# Altium schematic sheet CU.SchDoc
size A4
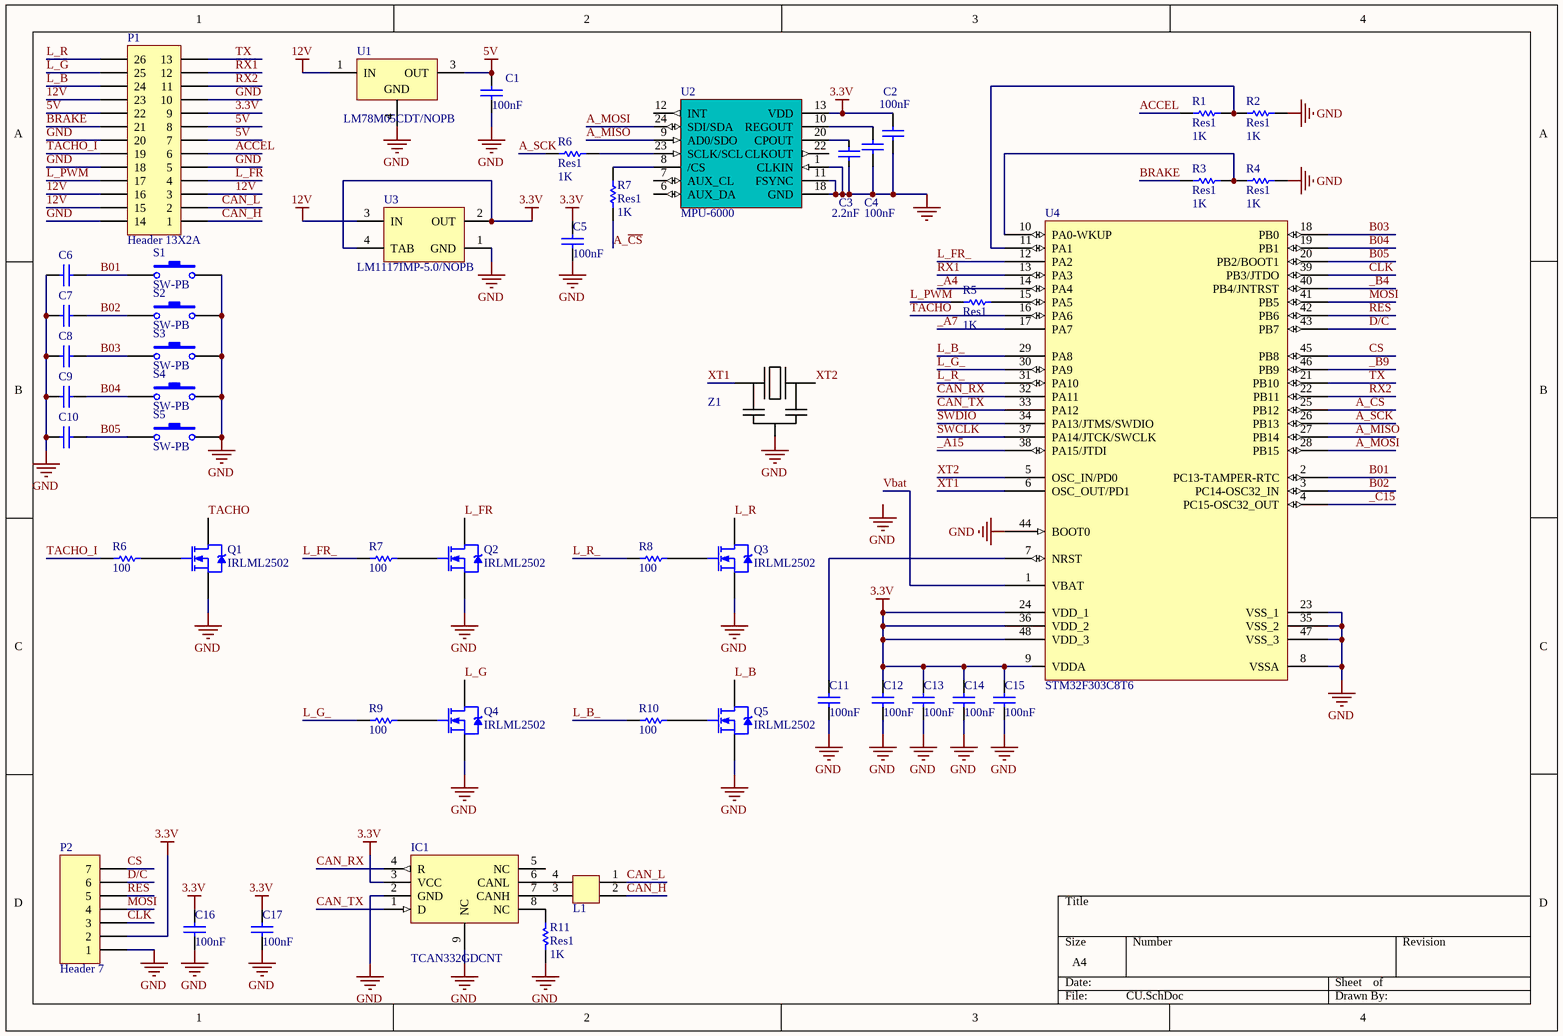
[diagram p0: CU.SchDoc]

## Parts
(Parts that share a designator on the sheet are numbered #1, #2 ... from top to bottom, then left to right.)
C1  value 100nF  [RR_B]  (hidden comment: Cap)
C2  value 100nF  [0603x]  (hidden comment: Cap402)
C3  value 2.2nF  [0603x]  (hidden comment: Cap603)
C4  value 100nF  [0402x]  (hidden comment: Cap402)
C5  value 100nF  [RR_B]  (hidden comment: Cap)
C6  Cap  [0402]  (value not drawn)
C7  Cap  [0402]  (value not drawn)
C8  Cap  [0402]  (value not drawn)
C9  Cap  [0402]  (value not drawn)
C10  Cap  [0402]  (value not drawn)
C11  value 100nF  [0402x]  (hidden comment: Cap)
C12  value 100nF  [0402x]  (hidden comment: Cap)
C13  value 100nF  [0402x]  (hidden comment: Cap)
C14  value 100nF  [0402x]  (hidden comment: Cap)
C15  value 100nF  [0402x]  (hidden comment: Cap)
C16  value 100nF  [0603x]  (hidden comment: Cap)
C17  value 100nF  [0603x]  (hidden comment: Cap)
IC1  TCAN332GDCNT  [RR_DFN8_3X3]
L1  CMC 100MA 2LN 90 OHM SMD  [Choke_smd]  (value not drawn)
P1  Header 13X2A  [HDR2X13_WIDE]
P2  Header 7  [OLED_DISPLAY_2.42]
Q1  IRLML2502  [SOT-23_N]
Q2  IRLML2502  [SOT-23_N]
Q3  IRLML2502  [SOT-23_N]
Q4  IRLML2502  [SOT-23_N]
Q5  IRLML2502  [SOT-23_N]
R1  Res1  value 1K  [0603x]
R2  Res1  value 1K  [0603x]
R3  Res1  value 1K  [0603x]
R4  Res1  value 1K  [0603x]
R5  Res1  value 1K  [0603x]
R6#1  Res1  value 1K  [0805x]
R6#2  value 100  [0603x]
R7#1  Res1  value 1K  [0603x]
R7#2  value 100  [0603x]
R8  value 100  [0603x]
R9  value 100  [0603x]
R10  value 100  [0603x]
R11  Res1  value 1K  [0603x]
S1  SW-PB  [BTN_WATEPROOF_RIGHT]
S2  SW-PB  [BTN_WATEPROOF_RIGHT]
S3  SW-PB  [BTN_WATEPROOF_RIGHT]
S4  SW-PB  [BTN_WATEPROOF_RIGHT]
S5  SW-PB  [BTN_WATEPROOF_RIGHT]
U1  LM78M05CDT/NOPB  [TD03B_N]
U2  MPU-6000  [IMU-3000]
U3  LM1117IMP-5.0/NOPB  [MP04A_N]
U4  STM32F303C8T6  [LQFP48_N]
Z1  AWSCR-8.00CV-T  [CRYSTAL_3.2X1.3]  (value not drawn)

## Nets
3.3V: C2.2 C5.2 C12.2 C13.2 C14.2 C15.2 C16.2 C17.2 IC1.3(VCC) P1.9 P2.2 U2.13(VDD) U3.2(OUT) U3.4(TAB) U4.9(VDDA) U4.24(VDD_1) U4.36(VDD_2) U4.48(VDD_3)
5V: C1.2 P1.7 P1.8 P1.22 U1.3(OUT)
12V: P1.3 P1.15 P1.16 P1.23 U1.1(IN) U3.3(IN)
GND: C1.1 C2.1 C3.1 C4.2 C5.1 C6.2 C7.2 C8.2 C9.2 C10.2 C11.1 C12.1 C13.1 C14.1 C15.1 C16.1 C17.1 IC1.2(GND) IC1.9(NC) P1.5 P1.10 P1.14 P1.18 P1.20 P2.1 Q1.2(S) Q2.2(S) Q3.2(S) Q4.2(S) Q5.2(S) R2.2 R4.2 R11.2 S1.1 S2.1 S3.1 S4.1 S5.1 U1.4(GND) U2.1(CLKIN) U2.11(FSYNC) U2.18(GND) U3.1(GND) U4.8(VSSA) U4.23(VSS_1) U4.35(VSS_2) U4.44(BOOT0) U4.47(VSS_3) Z1.2(GND)
_A4: U4.14(PA4)
_A7: U4.17(PA7)
_A15: U4.38(PA15/JTDI)
_B4: U4.40(PB4/JNTRST)
_B9: U4.46(PB9)
_C15: U4.4(PC15-OSC32_OUT)
A_~{CS}: R7#1.1 U4.25(PB12)
A_MISO: U2.9(AD0/SDO) U4.27(PB14)
A_MOSI: U2.24(SDI/SDA) U4.28(PB15)
A_SCK: R6#1.1 U4.26(PB13)
ACCEL: P1.6 R1.1
B01: C6.1 S1.2 U4.2(PC13-TAMPER-RTC)
B02: C7.1 S2.2 U4.3(PC14-OSC32_IN)
B03: C8.1 S3.2 U4.18(PB0)
B04: C9.1 S4.2 U4.19(PB1)
B05: C10.1 S5.2 U4.20(PB2/BOOT1)
BRAKE: P1.21 R3.1
CAN_H: L1.2 P1.1
CAN_L: L1.1 P1.2
CAN_RX: IC1.4(R) U4.32(PA11)
CAN_TX: IC1.1(D) U4.33(PA12)
CLK: P2.3 U4.39(PB3/JTDO)
CS: P2.7 U4.45(PB8)
D/C: P2.6 U4.43(PB7)
L_B: P1.24 Q5.3(D)
L_B_: R10.2 U4.29(PA8)
L_FR: P1.4 Q2.3(D)
L_FR_: R7#2.2 U4.12(PA2)
L_G: P1.25 Q4.3(D)
L_G_: R9.2 U4.30(PA9)
L_PWM: P1.17 R5.1
L_R: P1.26 Q3.3(D)
L_R_: R8.2 U4.31(PA10)
MOSI: P2.4 U4.41(PB5)
RES: P2.5 U4.42(PB6)
RX1: P1.12 U4.13(PA3)
RX2: P1.11 U4.22(PB11)
SWCLK: U4.37(PA14/JTCK/SWCLK)
SWDIO: U4.34(PA13/JTMS/SWDIO)
TACHO: Q1.3(D) U4.16(PA6)
TACHO_I: P1.19 R6#2.2
TX: P1.13 U4.21(PB10)
Vbat: U4.1(VBAT)
XT1: U4.6(OSC_OUT/PD1) Z1.1(X1)
XT2: U4.5(OSC_IN/PD0) Z1.3(X2)
NetC3_2: C3.2 U2.20(CPOUT)
NetC4_1: C4.1 U2.10(REGOUT)
NetC11_2: C11.2 U4.7(NRST)
NetIC1_6: IC1.6(CANL) L1.4
NetIC1_7: IC1.7(CANH) L1.3
NetIC1_8: IC1.8(NC) R11.1
NetQ1_1: Q1.1(G) R6#2.1
NetQ2_1: Q2.1(G) R7#2.1
NetQ3_1: Q3.1(G) R8.1
NetQ4_1: Q4.1(G) R9.1
NetQ5_1: Q5.1(G) R10.1
NetR1_2: R1.2 R2.1 U4.11(PA1)
NetR3_2: R3.2 R4.1 U4.10(PA0-WKUP)
NetR5_2: R5.2 U4.15(PA5)
NetR6#1_2: R6#1.2 U2.23(SCLK/SCL)
NetR7#1_2: R7#1.2 U2.8(/CS)

Not connected (* = marked no-connect by the designer): IC1 5(NC); U2 2(NC) 3(NC) 4(NC) 5(NC) 6(AUX_DA) 7(AUX_CL) 12(INT) 14(NC) 15(NC) 16(NC) 17(NC) 19(RESV) 21(RESV) 22(CLKOUT)

## Notes on the sheet
- Labels drawn without touching a wire or pin: GND

## Library data of the parts
C1 C5 C11-C17 = Cap: Capacitor; Published: 8-Jun-2000; LatestRevisionDate: 17-Jul-2002; LatestRevisionNote: Re-released for DXP Platform.; PackageReference: RAD-0.3; Publisher: Altium Limited; PackageDescription: Radial Cap, Thru-Hole; 2 Leads; 0.3 in Pin Spacing
C2 C4 = Cap402: Capacitor SMD; Published: 1-Nov-2010; LatestRevisionDate: 1-Nov-2010; LatestRevisionNote: Released OpenPilot Lib; PackageReference: 0402 (1005 Metric); Publisher: The OpenPilot Project; ComponentLink2Description: Datasheet; Supplier 1: Digi-Key; Supplier Part Number 1: 445-4952-1-ND
C3 = Cap603: Capacitor SMD; Published: 1-Nov-2010; LatestRevisionDate: 1-Nov-2010; LatestRevisionNote: Released OpenPilot Lib; PackageReference: 0603 (1608 Metric); Publisher: The OpenPilot Project; Supplier 1: Digi-Key; Supplier Part Number 1: 445-1309-1-ND
C6-C10 = Cap: Capacitor; Value: 100nF; Published: 8-Jun-2000; LatestRevisionDate: 17-Jul-2002; LatestRevisionNote: Re-released for DXP Platform.; PackageReference: RAD-0.3; Publisher: Altium Limited; PackageDescription: Radial Cap, Thru-Hole; 2 Leads; 0.3 in Pin Spacing
L1 = Choke: Order Number: EXC-34CG900U; Distributor: Panasonic; Value: CMC 100MA 2LN 90 OHM SMD; Package: 0805 (2012 Metric), 4 PC Pad
P1 = Header 13X2A: Header, 13-Pin, Dual row; LatestRevisionDate: 17-Jul-2002; LatestRevisionNote: Re-released for DXP Platform.; Publisher: Altium Limited
P2 = Header 7: Header, 7-Pin; LatestRevisionDate: 17-Jul-2002; LatestRevisionNote: Re-released for DXP Platform.; Publisher: Altium Limited
Q1-Q5 = IRLML2402: HEXFET Power MOSFET; Published: 8-Jun-2000; LatestRevisionDate: 20-Nov-2009; LatestRevisionNote: IPC-7351 Footprint Added.; DatasheetVersion: Aug-1997; PackageReference: SOT-23; Publisher: Altium Limited; PackageDescription: 3-Pin SOT-23 Package 0.95 mm Pitch, 2.3 mm Lead Span; ComponentLink1Description: Manufacturer Link; ComponentLink1URL: http://www.irf.com/; ComponentLink2Description: Datasheet; ComponentLink2URL: http://www.irf.com/product-info/datasheets/data/irlml2402.pdf
R1-R5 R6#1 R6#2 R7#1 R7#2 R8-R11 = Res1: Resistor; Published: 8-Jun-2000; LatestRevisionDate: 17-Jul-2002; LatestRevisionNote: Re-released for DXP Platform.; PackageReference: AXIAL-0.3; Publisher: Altium Limited; PackageDescription: Axial Device, Thru-Hole; 2 Leads; 0.3 in Pin Spacing
S1-S5 = SW-PB: Switch; Published: 24-Mar-1999; LatestRevisionDate: 17-Jul-2002; LatestRevisionNote: Re-released for DXP Platform.; PackageReference: SPST-2; Publisher: Altium Limited; PackageDescription: Switch; 2 Leads
U1 = LM78M05CDT/NOPB: 3-Terminal Positive Voltage Regulators, 3-pin TO-252, Pb-Free; Manufacturer: National Semiconductor; PackageTopMarking: NSUZXYTT*LM78M05*CDT; PowerWise: N; CompType: LDO IC; Published: 1-Mar-2010; DatasheetVersion: Aug-2005; PackageVersion: revD, Feb-2009; PackageReference: TD03B; Publisher: Altium Limited; PackageDescription: TO252, Molded, Jedec, 6.8 x 6.10 x 2.30mm Body, 3 Lead, 2.28mm Pitch, Surface Mount; Supplier 1: Digi-Key; Supplier Part Number 1: LM78M05CDT-ND; Supplier 2: Farnell; Supplier Part Number 2: 1469112; PartNumber: LM78M05CDT/NOPB; RoHS: Y; PinCount: 3; Code_JEDEC: TO-252-AA; ComponentLink1Description: LM78M05 Datasheet; ComponentLink1URL: http://www.national.com/ds/LM/LM78M05.pdf; ComponentLink2Description: LM78M05 Web Page; ComponentLink2URL: http://www.national.com/pf/LM/LM78M05.html; ComponentLink3Description: TD03B Package Page; ComponentLink3URL: http://www.national.com/packaging/folders/td03b.html
U2 = MPU-3/6000: Invensense MPU-3/6000,  3-axis Gyros & Accel on 6000; ComponentLink2Description: Datasheet; LatestRevisionDate: 1-Nov-2010; LatestRevisionNote: Released OpenPilot Lib; Published: 1-Nov-2010; Publisher: The OpenPilot Project; Manufacturer: Invensense; Supplier 1: Invensense; Supplier Part Number 1: MPU-6000
U3 = LM1117IMP-5.0/NOPB: 800mA Low-Dropout Linear Regulator, 4-pin SOT-223, Pb-Free; Manufacturer: National Semiconductor; PackageTopMarking: XYTT*N06B; PowerWise: N; CompType: LDO IC; Published: 1-Mar-2010; DatasheetVersion: Apr-2006; PackageVersion: revB, Apr-2003; PackageReference: MP04A; Publisher: Altium Limited; PackageDescription: Molded SOT-223, 6.50 x 3.56 x 1.6mm Body, 4 Lead, 2.3mm Pitch; Supplier 1: Digi-Key; Supplier Part Number 1: LM1117IMP-5.0TR-ND; Supplier 2: Digi-Key; Supplier Part Number 2: LM1117IMP-5.0CT-ND; Supplier 3: Digi-Key; Supplier Part Number 3: LM1117IMP-5.0DKR-ND; Supplier 4: Farnell; Supplier Part Number 4: 1469052; PartNumber: LM1117IMP-5.0/NOPB; RoHS: Y; PinCount: 4; Code_JEDEC: TO-261-AA; Code_IPC: SOT223-4; ComponentLink1Description: LM1117 Datasheet; ComponentLink1URL: http://www.national.com/ds/LM/LM1117.pdf; ComponentLink2Description: LM1117 Web Page; ComponentLink2URL: http://www.national.com/pf/LM/LM1117.html; ComponentLink3Description: MP04A Package Page; ComponentLink3URL: http://www.national.com/packaging/folders/mp04a.html
U4 = STM32F103C6T6: STM32 ARM-based 32-bit MCU with 32 Kbytes Flash, 48-pin LQFP, Industrial Temperature; Published: 30-May-2008; DatasheetVersion: rev6, Mar-2008; PackageVersion: Mar-2008; PackageReference: LQFP48; Publisher: Altium Limited; PackageDescription: 48-Pin Low-Profile Quad Flat Pack, 7 x 7 mm Body, 0.5 mm Pitch (LQFP48); ComponentLink1Description: Manufacturer Link; ComponentLink1URL: www.st.com/stm32; ComponentLink2Description: Datasheet; ComponentLink2URL: http://www.st.com/stonline/products/literature/ds/13587.pdf
Z1 = Crystal_smd_with_caps: Value: CER RES 8.0000MHZ 22PF SMD; Order Number: AWSCR-8.00CV-T; Distributor: Abracon LLC; Package: 3-SMD, Non-Standard
IC1 = TCAN332GDCNT: Order Number: TCAN332GDCNT; Package: SOT23-8; Value: TCAN332GDCNT; Distributor: Texas Instruments